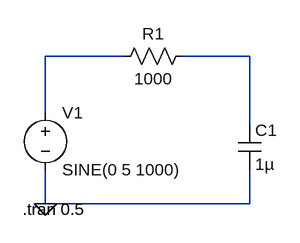
[diagram p0: schematic RC_Circuit.asc]
RC_Circuit.asc, the LTspice schematic file:
Version 4.1
SHEET 1 880 680
WIRE 112 64 0 64
WIRE 288 64 192 64
WIRE 0 144 0 64
WIRE 288 160 288 64
WIRE 0 272 0 224
WIRE 288 272 288 224
WIRE 288 272 0 272
FLAG 0 272 0
SYMBOL voltage 0 128 R0
WINDOW 123 0 0 Left 0
WINDOW 39 0 0 Left 0
SYMATTR InstName V1
SYMATTR Value SINE(0 5 1000)
SYMBOL res 208 48 R90
WINDOW 0 0 56 VBottom 2
WINDOW 3 32 56 VTop 2
SYMATTR InstName R1
SYMATTR Value 1000
SYMBOL cap 272 160 R0
SYMATTR InstName C1
SYMATTR Value 1µ
TEXT -32 280 Left 2 !.tran 0.5

The netlist it stands for:
* RC_Circuit.asc
V1 N001 0 SINE(0 5 1000)
R1 N002 N001 1000
C1 N002 0 1µ
.tran 0.5
.backanno
.end